# Altium schematic sheet RF_load.SchDoc
size 420 x 297 mm; SheetNumber: 1; SheetTotal: 1
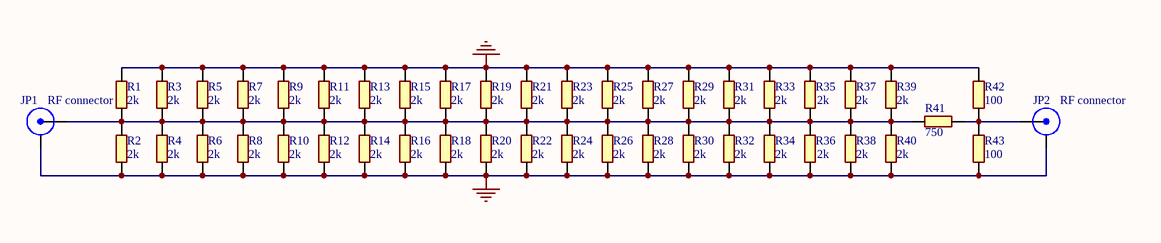
[diagram p0: RF_load.SchDoc]

## Parts
JP1  RF connector  [AMPHENOL_132357-11]
JP2  RF connector  [AMPHENOL_132357-11]
R1  2k  [R-1206 _narrow]
R2  2k  [R-1206 _narrow]
R3  2k  [R-1206 _narrow]
R4  2k  [R-1206 _narrow]
R5  2k  [R-1206 _narrow]
R6  2k  [R-1206 _narrow]
R7  2k  [R-1206 _narrow]
R8  2k  [R-1206 _narrow]
R9  2k  [R-1206 _narrow]
R10  2k  [R-1206 _narrow]
R11  2k  [R-1206 _narrow]
R12  2k  [R-1206 _narrow]
R13  2k  [R-1206 _narrow]
R14  2k  [R-1206 _narrow]
R15  2k  [R-1206 _narrow]
R16  2k  [R-1206 _narrow]
R17  2k  [R-1206 _narrow]
R18  2k  [R-1206 _narrow]
R19  2k  [R-1206 _narrow]
R20  2k  [R-1206 _narrow]
R21  2k  [R-1206 _narrow]
R22  2k  [R-1206 _narrow]
R23  2k  [R-1206 _narrow]
R24  2k  [R-1206 _narrow]
R25  2k  [R-1206 _narrow]
R26  2k  [R-1206 _narrow]
R27  2k  [R-1206 _narrow]
R28  2k  [R-1206 _narrow]
R29  2k  [R-1206 _narrow]
R30  2k  [R-1206 _narrow]
R31  2k  [R-1206 _narrow]
R32  2k  [R-1206 _narrow]
R33  2k  [R-1206 _narrow]
R34  2k  [R-1206 _narrow]
R35  2k  [R-1206 _narrow]
R36  2k  [R-1206 _narrow]
R37  2k  [R-1206 _narrow]
R38  2k  [R-1206 _narrow]
R39  2k  [R-1206 _narrow]
R40  2k  [R-1206 _narrow]
R41  750  [R-1206 _narrow]
R42  100  [R-1206 _narrow]
R43  100  [R-1206 _narrow]

## Nets
GND: JP1.2(Y) JP2.2(Y) R1.2 R2.1 R3.2 R4.1 R5.2 R6.1 R7.2 R8.1 R9.2 R10.1 R11.2 R12.1 R13.2 R14.1 R15.2 R16.1 R17.2 R18.1 R19.2 R20.1 R21.2 R22.1 R23.2 R24.1 R25.2 R26.1 R27.2 R28.1 R29.2 R30.1 R31.2 R32.1 R33.2 R34.1 R35.2 R36.1 R37.2 R38.1 R39.2 R40.1 R42.2 R43.1
NetJP1_1: JP1.1(X) R1.1 R2.2 R3.1 R4.2 R5.1 R6.2 R7.1 R8.2 R9.1 R10.2 R11.1 R12.2 R13.1 R14.2 R15.1 R16.2 R17.1 R18.2 R19.1 R20.2 R21.1 R22.2 R23.1 R24.2 R25.1 R26.2 R27.1 R28.2 R29.1 R30.2 R31.1 R32.2 R33.1 R34.2 R35.1 R36.2 R37.1 R38.2 R39.1 R40.2 R41.2
NetJP2_1: JP2.1(X) R41.1 R42.1 R43.2

## Notes on the sheet
- Перв. примен.
- Справ. №
- Подп. и дата
- Инв. № дубл.
- Взам. инв. №
- Изм.
- Лист
- № докум.
- Подп.
- Дата
- Лит.
- Масса
- Масштаб
- Т.контр.
- Пров.
- Разраб.
- Листов
- Инв. № подл.
- Н.контр.
- Утв.
- Копировал
- Формат А3

## Library data of the parts
JP1 JP2 = RF connector: Вид: Роз'єм; *: *
R1-R43 = RES: Точність/група: 5%; Вид: Резистор